# EAGLE design otterley_A_v1_1 (EAGLE 9.6.2)

## Sheet 1 of 2: LFO B
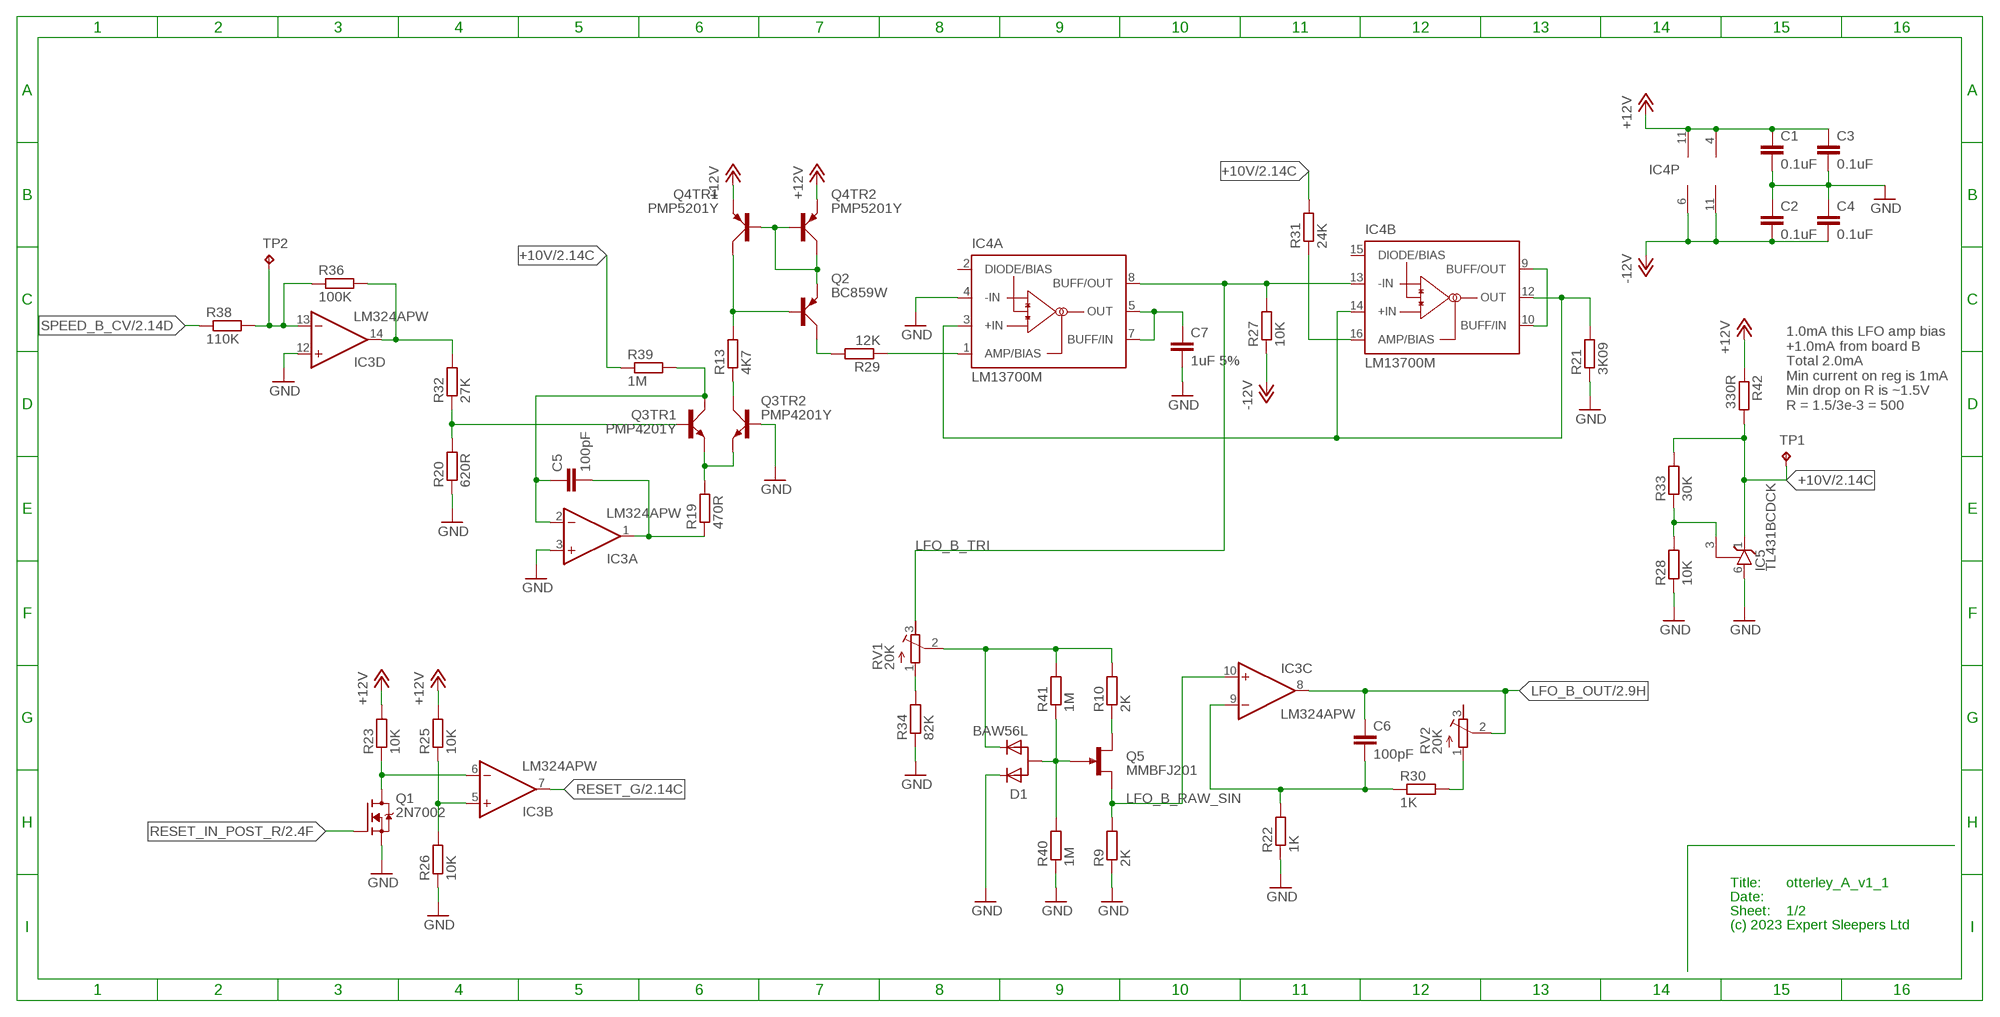
[diagram p0: schematic, sheet 1]

### Parts
C1  0.1uF  C-EUC0402  [C0402]
C2  0.1uF  C-EUC0402  [C0402]
C3  0.1uF  C-EUC0402  [C0402]
C4  0.1uF  C-EUC0402  [C0402]
C5  100pF  C-EUC0603  [C0603]
C6  100pF  C-EUC0603  [C0603]
C7  1uF 5%  C-EUC0805  [C0805]
D1  BAW56L  [SOT-23]
IC3  LM324APW  TL074PW  [PW_R-PDSO-G14]
IC4  LM13700M  [SO16]
IC5  TL431BCDCK  [DCK_SC-70]
Q1  2N7002  [SOT23]
Q2  BC859W  [SOT323]
Q3  PMP4201Y  [SOT65P210X110-6N]
Q4  PMP5201Y  [SOT65P210X110-6N]
Q5  MMBFJ201  MMBFJ3  [SOT23]
R9  2K  R-EU_R1206  [R1206]
R10  2K  R-EU_R1206  [R1206]
R13  4K7  R-EU_R1206  [R1206]
R19  470R  R-EU_R1206  [R1206]
R20  620R  R-EU_R0603  [R0603]
R21  3K09  R-EU_R0603  [R0603]
R22  1K  R-EU_R0603  [R0603]
R23  10K  R-EU_R0603  [R0603]
R25  10K  R-EU_R0603  [R0603]
R26  10K  R-EU_R0603  [R0603]
R27  10K  R-EU_R0603  [R0603]
R28  10K  R-EU_R0603  [R0603]
R29  12K  R-EU_R0603  [R0603]
R30  1K  R-EU_R0603  [R0603]
R31  24K  R-EU_R0603  [R0603]
R32  27K  R-EU_R0603  [R0603]
R33  30K  R-EU_R0603  [R0603]
R34  82K  R-EU_R0603  [R0603]
R36  100K  R-EU_R0603  [R0603]
R38  110K  R-EU_R0603  [R0603]
R39  1M  R-EU_R0603  [R0603]
R40  1M  R-EU_R0603  [R0603]
R41  1M  R-EU_R0603  [R0603]
R42  330R  R-EU_R1206  [R1206]
RV1  20K  3306W  [3306_W]
RV2  20K  3306W  [3306_W]
TP1  RA2  TPPAD1-13  [P1-13]
TP2  RA2  TPPAD1-13  [P1-13]

### Nets
+10V: IC5.1(C) R31.2 R33.2 R39.1 R42.2 TP1.TP ; also sheet 2
+12V: C1.1 C3.1 IC3.4(P:V+) IC4.11(P:V+) Q4.4(TR2:E) Q4.5(TR1:E) R23.2 R25.2 R42.1 ; also sheet 2
-12V: C2.2 C4.2 IC3.11(P:V-) IC4.6(P:V-) R27.1 ; also sheet 2
GND [power]: C1.2 C2.1 C3.2 C4.1 C7.2 D1.1(C1) IC3.3(A:+IN) IC3.12(D:+IN) IC4.4(A:-IN) IC5.6(A) Q1.2(S) Q3.2(TR2:B) R9.1 R20.1 R21.1 R22.1 R26.1 R28.1 R34.1 R40.1 ; also sheet 2
LFO_B_OUT: C6.1 IC3.8(C:OUT) RV2.2(S) ; also sheet 2
LFO_B_RAW_SIN: IC3.10(C:+IN) Q5.2(S) R9.2
LFO_B_TRI: IC4.8(A:BUFF/OUT) IC4.13(B:-IN) R27.2 RV1.3(E)
N$21: IC5.3(R) R28.2 R33.1
N$45: IC3.6(B:-IN) Q1.3(D) R23.1
N$46: IC3.5(B:+IN) R25.1 R26.2
N$50: IC3.14(D:OUT) R32.2 R36.2
N$55: IC4.9(B:BUFF/OUT) IC4.10(B:BUFF/IN)
N$59: C7.1 IC4.5(A:OUT) IC4.7(A:BUFF/IN)
N$60: IC4.3(A:+IN) IC4.12(B:OUT) IC4.14(B:+IN) R21.2
N$61: IC4.16(B:AMP/BIAS) R31.1
N$64: IC4.1(A:AMP/BIAS) R29.1
N$67: IC3.13(D:-IN) R36.1 R38.2 TP2.TP
N$68: C5.1 IC3.2(A:-IN) Q3.6(TR1:C) R39.2
N$69: C5.2 IC3.1(A:OUT) R19.1
N$70: Q3.4(TR2:E) Q3.5(TR1:E) R19.2
N$73: Q3.1(TR1:B) R20.2 R32.1
N$76: Q2.3(C) R29.2
N$77: Q2.1(B) Q4.6(TR1:C) R13.2
N$78: Q2.2(E) Q4.1(TR1:B) Q4.2(TR2:B) Q4.3(TR2:C)
N$79: Q3.3(TR2:C) R13.1
N$82: R34.2 RV1.1(A)
N$83: D1.2(C2) R10.2 R41.2 RV1.2(S)
N$84: D1.3(A) Q5.3(G) R40.2 R41.1
N$85: Q5.1(D) R10.1
N$86: C6.2 IC3.9(C:-IN) R22.2 R30.1
N$88: R30.2 RV2.1(A)
RESET_G: IC3.7(B:OUT) ; also sheet 2
RESET_IN_POST_R: Q1.1(G) ; also sheet 2
SPEED_B_CV: R38.1 ; also sheet 2
Unconnected: IC4.2(A:DIODE/BIAS) IC4.15(B:DIODE/BIAS) RV2.3(E)

### Notes on the sheet
- 1.0mA this LFO amp bias
  +1.0mA from board B
  Total 2.0mA
  Min current on reg is 1mA
  Min drop on R is ~1.5V
  R = 1.5/3e-3 = 500
- Title:
- Date:
- Sheet:
- (c) 2023 Expert Sleepers Ltd

## Sheet 2 of 2: CV I/O
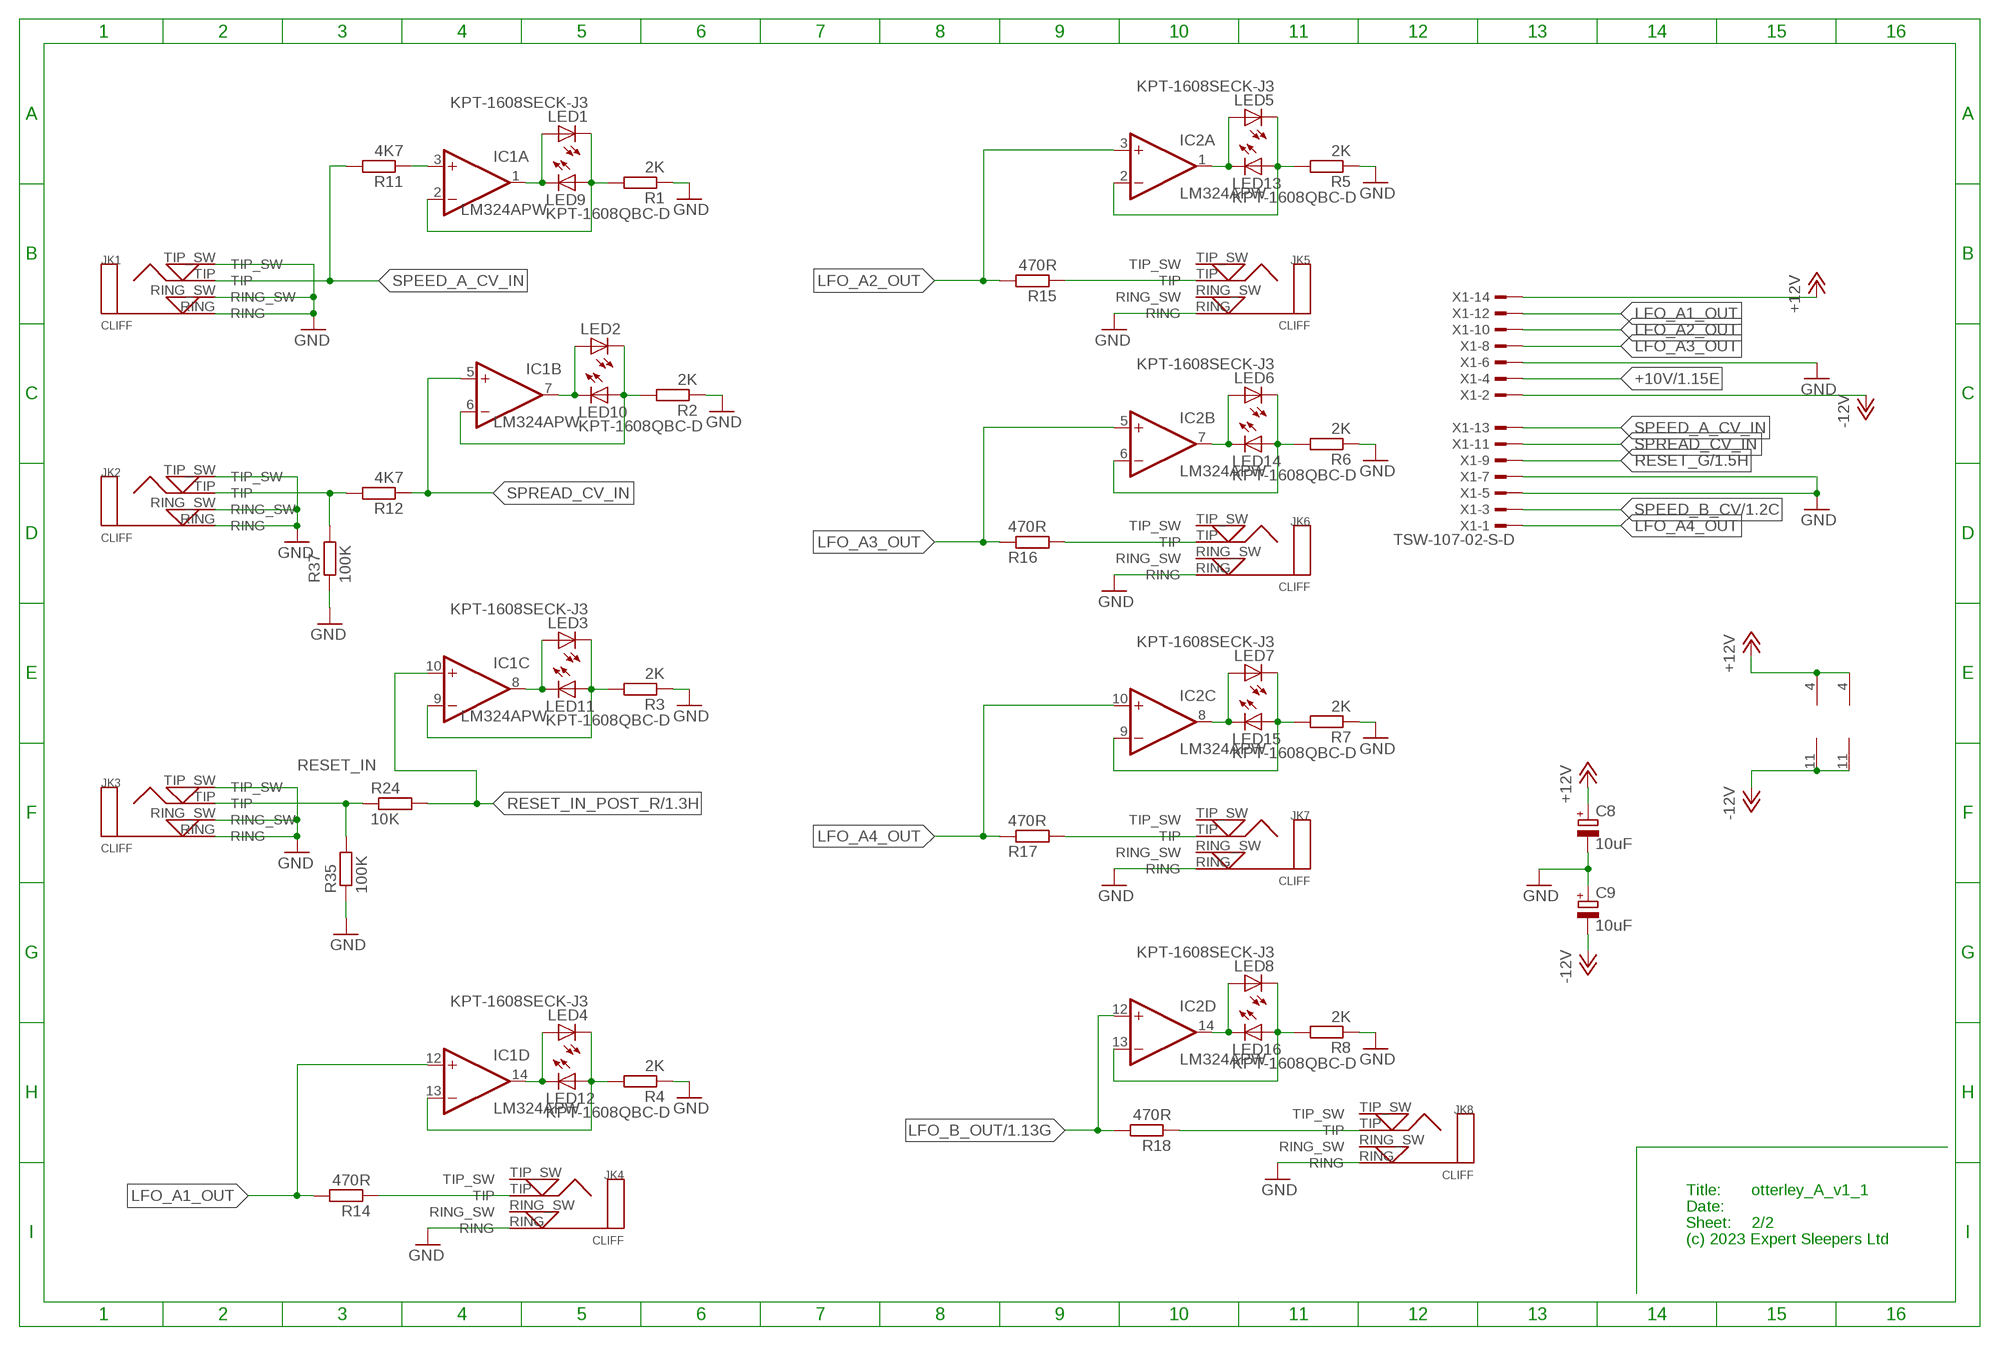
[diagram p1: schematic, sheet 2]

### Parts
C8  10uF  CPOL-EUUD-4X5,8  [UD-4X5,8_NICHICON]
C9  10uF  CPOL-EUUD-4X5,8  [UD-4X5,8_NICHICON]
IC1  LM324APW  TL074PW  [PW_R-PDSO-G14]
IC2  LM324APW  TL074PW  [PW_R-PDSO-G14]
JK1  CLIFF  CLIFF3.5MM_PCB_SW_JK  [CLIFF3.5MMPCB]
JK2  CLIFF  CLIFF3.5MM_PCB_SW_JK  [CLIFF3.5MMPCB]
JK3  CLIFF  CLIFF3.5MM_PCB_SW_JK  [CLIFF3.5MMPCB]
JK4  CLIFF  CLIFF3.5MM_PCB_SW_JK  [CLIFF3.5MMPCB]
JK5  CLIFF  CLIFF3.5MM_PCB_SW_JK  [CLIFF3.5MMPCB]
JK6  CLIFF  CLIFF3.5MM_PCB_SW_JK  [CLIFF3.5MMPCB]
JK7  CLIFF  CLIFF3.5MM_PCB_SW_JK  [CLIFF3.5MMPCB]
JK8  CLIFF  CLIFF3.5MM_PCB_SW_JK  [CLIFF3.5MMPCB]
LED1  KPT-1608SECK-J3  [CHIPLED_0603_LEFT]
LED2  KPT-1608SECK-J3  [CHIPLED_0603_LEFT]
LED3  KPT-1608SECK-J3  [CHIPLED_0603_LEFT]
LED4  KPT-1608SECK-J3  [CHIPLED_0603_LEFT]
LED5  KPT-1608SECK-J3  [CHIPLED_0603_LEFT]
LED6  KPT-1608SECK-J3  [CHIPLED_0603_LEFT]
LED7  KPT-1608SECK-J3  [CHIPLED_0603_LEFT]
LED8  KPT-1608SECK-J3  [CHIPLED_0603_LEFT]
LED9  KPT-1608QBC-D  [CHIPLED_0603_RIGHT]
LED10  KPT-1608QBC-D  [CHIPLED_0603_RIGHT]
LED11  KPT-1608QBC-D  [CHIPLED_0603_RIGHT]
LED12  KPT-1608QBC-D  [CHIPLED_0603_RIGHT]
LED13  KPT-1608QBC-D  [CHIPLED_0603_RIGHT]
LED14  KPT-1608QBC-D  [CHIPLED_0603_RIGHT]
LED15  KPT-1608QBC-D  [CHIPLED_0603_RIGHT]
LED16  KPT-1608QBC-D  [CHIPLED_0603_RIGHT]
R1  2K  R-EU_R1206  [R1206]
R2  2K  R-EU_R1206  [R1206]
R3  2K  R-EU_R1206  [R1206]
R4  2K  R-EU_R1206  [R1206]
R5  2K  R-EU_R1206  [R1206]
R6  2K  R-EU_R1206  [R1206]
R7  2K  R-EU_R1206  [R1206]
R8  2K  R-EU_R1206  [R1206]
R11  4K7  R-EU_R1206  [R1206]
R12  4K7  R-EU_R1206  [R1206]
R14  470R  R-EU_R1206  [R1206]
R15  470R  R-EU_R1206  [R1206]
R16  470R  R-EU_R1206  [R1206]
R17  470R  R-EU_R1206  [R1206]
R18  470R  R-EU_R1206  [R1206]
R24  10K  R-EU_R0603  [R0603]
R35  100K  R-EU_R0603  [R0603]
R37  100K  R-EU_R0603  [R0603]
X1  TSW-107-02-S-D  [TSW-107-02-S-D]

### Nets
+10V: X1.4 ; also sheet 1
+12V: C8.+ IC1.4(P:V+) IC2.4(P:V+) X1.14 ; also sheet 1
-12V: C9.- IC1.11(P:V-) IC2.11(P:V-) X1.2 ; also sheet 1
GND [power]: C8.- C9.+ JK1.RING JK1.RING_SW JK1.TIP_SW JK2.RING JK2.RING_SW JK2.TIP_SW JK3.RING JK3.RING_SW JK3.TIP_SW JK4.RING JK5.RING JK6.RING JK7.RING JK8.RING R1.1 R2.1 R3.1 R4.1 R5.1 R6.1 R7.1 R8.1 R35.1 R37.1 X1.5 X1.6 X1.7 ; also sheet 1
LFO_A1_JACK: JK4.TIP R14.1
LFO_A1_OUT: IC1.12(D:+IN) R14.2 X1.12
LFO_A2_JACK: JK5.TIP R15.1
LFO_A2_OUT: IC2.3(A:+IN) R15.2 X1.10
LFO_A3_JACK: JK6.TIP R16.2
LFO_A3_OUT: IC2.5(B:+IN) R16.1 X1.8
LFO_A4_JACK: JK7.TIP R17.2
LFO_A4_OUT: IC2.10(C:+IN) R17.1 X1.1
LFO_B_JACK: JK8.TIP R18.1
LFO_B_OUT: IC2.12(D:+IN) R18.2 ; also sheet 1
N$4: IC1.13(D:-IN) LED4.1(C) LED12.1(A) R4.2
N$5: IC1.14(D:OUT) LED4.2(A) LED12.2(C)
N$6: IC2.2(A:-IN) LED5.1(C) LED13.1(A) R5.2
N$11: IC1.8(C:OUT) LED3.2(A) LED11.2(C)
N$16: JK2.TIP R12.2 R37.2
N$17: IC1.9(C:-IN) LED3.1(C) LED11.1(A) R3.2
N$19: IC1.1(A:OUT) LED1.2(A) LED9.2(C)
N$22: IC1.2(A:-IN) LED1.1(C) LED9.1(A) R1.2
N$25: IC1.3(A:+IN) R11.1
N$29: IC1.7(B:OUT) LED2.2(A) LED10.2(C)
N$30: IC1.6(B:-IN) LED2.1(C) LED10.1(A) R2.2
N$62: IC2.8(C:OUT) LED7.2(A) LED15.2(C)
N$63: IC2.9(C:-IN) LED7.1(C) LED15.1(A) R7.2
N$65: IC2.14(D:OUT) LED8.2(A) LED16.2(C)
N$66: IC2.13(D:-IN) LED8.1(C) LED16.1(A) R8.2
N$71: IC2.7(B:OUT) LED6.2(A) LED14.2(C)
N$72: IC2.6(B:-IN) LED6.1(C) LED14.1(A) R6.2
N$89: IC2.1(A:OUT) LED5.2(A) LED13.2(C)
RESET_G: X1.9 ; also sheet 1
RESET_IN: JK3.TIP R24.1 R35.2
RESET_IN_POST_R: IC1.10(C:+IN) R24.2 ; also sheet 1
SPEED_A_CV_IN: JK1.TIP R11.2 X1.13
SPEED_B_CV: X1.3 ; also sheet 1
SPREAD_CV_IN: IC1.5(B:+IN) R12.1 X1.11
Unconnected: JK4.RING_SW JK4.TIP_SW JK5.RING_SW JK5.TIP_SW JK6.RING_SW JK6.TIP_SW JK7.RING_SW JK7.TIP_SW JK8.RING_SW JK8.TIP_SW

### Notes on the sheet
- Title:
- Date:
- Sheet:
- (c) 2023 Expert Sleepers Ltd

## Library data of the parts
C1-C7 = rcl:C-EU: CAPACITOR, European symbol
C8 C9 = rcl:CPOL-EU: POLARIZED CAPACITOR, European symbol
D1 = diodes:BAW56L
IC1-IC3 = digital-audio:TL074: OP AMP
IC4 = texas:LM13700: Dual Operational Transconductance Amplifiers with Linearizing Diodes and Buffers Source: lm13700.PDF
IC5 = texas:TL431*
JK1-JK8 = cliff:CLIFF3.5MM_PCB_SW_JK: Cliff 3.5mm Mono PCB switched jack socket
LED1-LED8 = kingbright:KPT-1608SECK-J3
LED9-LED16 = kingbright:KPT-1608QBC-D
Q1 = digital-audio:2N7002: 2N7002 N-channel MOSFET
Q2 = NXP:BC859W
Q3 = SamacSys_Parts:PMP4201Y: Bipolar Transistors - BJT MATCHED PAIR Source: Datasheet <https://componentsearchengine.com/Datasheets/1/PMP4201Y,135.pdf>; ARROW_PART_NUMBER: PMP4201Y,135; ARROW_PRICE-STOCK: https://www.arrow.com/en/products/pmp4201y135/nexperia; DESCRIPTION: Bipolar Transistors - BJT MATCHED PAIR; HEIGHT: 1.1mm; MANUFACTURER_NAME: Nexperia; MANUFACTURER_PART_NUMBER: PMP4201Y,135; MOUSER_PART_NUMBER: 771-PMP4201Y135; MOUSER_PRICE-STOCK: https://www.mouser.co.uk/ProductDetail/Nexperia/PMP4201Y135?qs=LOCUfHb8d9uqwNS3d98RHQ%3D%3D
Q4 = SamacSys_Parts:PMP5201Y: Bipolar Transistors - BJT MATCHED PAIR Source: Datasheet <https://eu.mouser.com/datasheet/2/268/40001414E-1066494.pdf>; ARROW_PART_NUMBER: PMP5201Y,135; ARROW_PRICE-STOCK: https://www.arrow.com/en/products/pmp5201y135/nexperia; DESCRIPTION: Bipolar Transistors - BJT MATCHED PAIR; HEIGHT: 1.1mm; MANUFACTURER_NAME: Nexperia; MANUFACTURER_PART_NUMBER: PMP5201Y,135; MOUSER_PART_NUMBER: 771-PMP5201Y135; MOUSER_PRICE-STOCK: https://www.mouser.co.uk/ProductDetail/Nexperia/PMP5201Y135?qs=LOCUfHb8d9vvvsx1DGNhtA%3D%3D
Q5 = transistor-small-signal:MMBFJ3*: N-Channel RF Amplifier Source: http://www.fairchildsemi.com/pf/J3/J310.html
R1-R42 = rcl:R-EU_: RESISTOR, European symbol
RV1 RV2 = bourns:3306
TP1 TP2 = testpad:TP: Test pad
X1 = con-samtec:TSW-107-02-S-D: THROUGH-HOLE .025" SQ POST HEADER Source: Samtec TSW.pdf; OC_FARNELL: unknown; OC_NEWARK: unknown

## Board
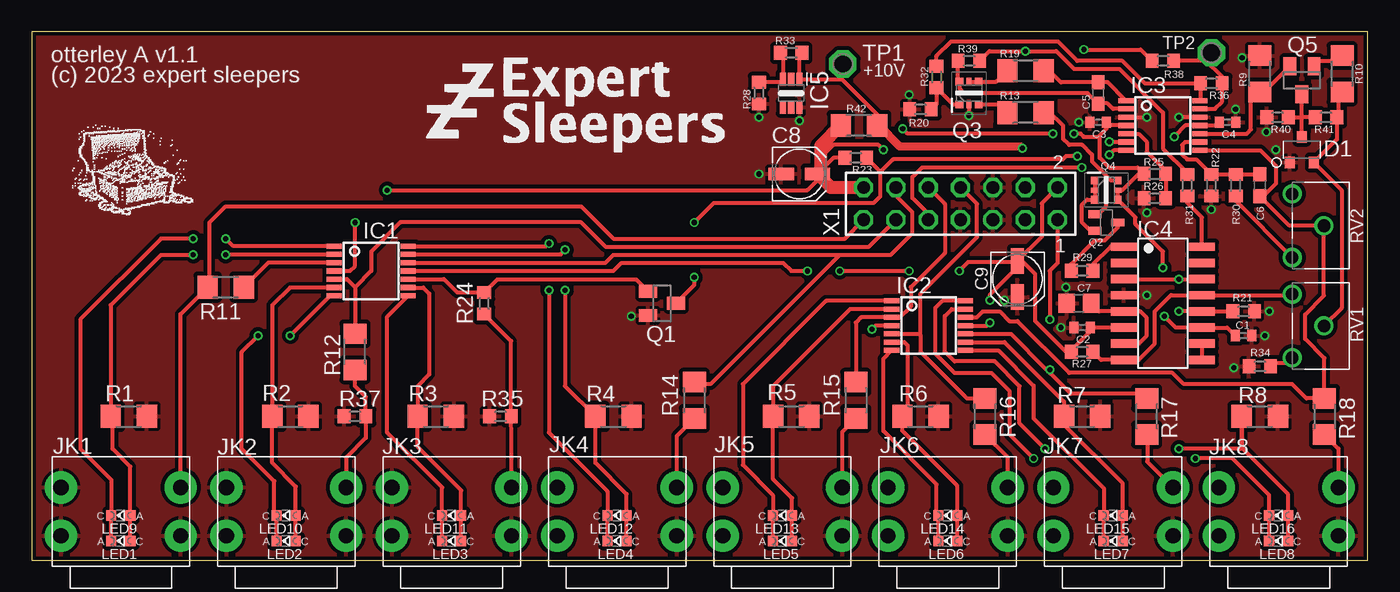
[diagram p2: board, top side]
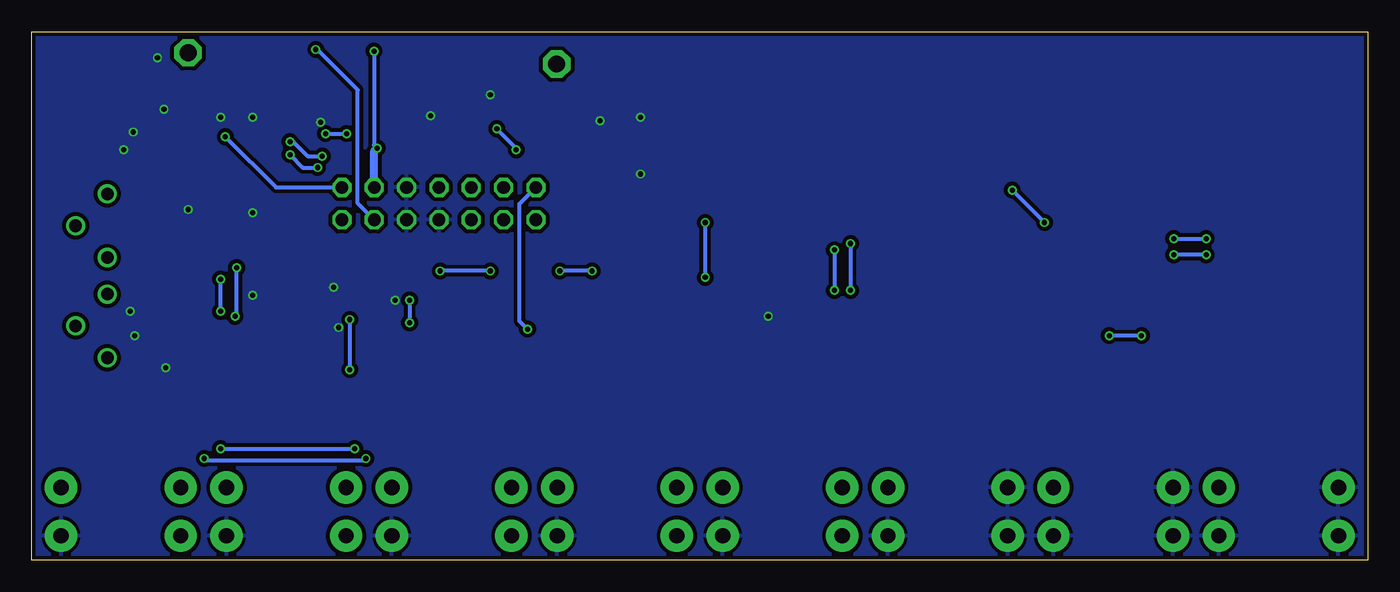
[diagram p3: board, bottom side, seen from below]

Size 105 x 41.5 mm. Coordinates in mm from the lower left corner, seen from the top.
Outline: 0,0 105,0 105,41.5 0,41.5 0,0
Copper layers (1*16): Top 0.035mm / dielectric 1.5mm / Bottom 0.035mm
Design rules "pcbtrain *": minimum track width 0.125mm, minimum drill 0.3mm, track to track 0.125mm, track to pad 0.125mm, pad to pad 0.125mm, via to via 0.125mm, smd to smd 0.125mm, copper to edge 0.25mm, drill to drill 8mil, minimum pad ring 0.15mm, minimum via ring 0.15mm, stop-mask expansion 4mil, vias tented up to drill 0mil, thermal gap 10mil

### Footprints (pad centres in the part's own frame; a part is rotated, then mirrored left to right if it is on the bottom)
C0402 = smd 0.7 x 0.9: 1 -0.65,0; 2 0.65,0
C0603 = smd 1.1 x 1: 1 -0.85,0; 2 0.85,0
C0805 = smd 1.3 x 1.5: 1 -0.95,0; 2 0.95,0
UD-4X5,8_NICHICON = smd 2 x 1: + 1.425,0; - -1.425,0
SOT-23 = smd 0.8 x 0.9: 1 -0.95,-1; 2 0.95,-1; 3 0,1
PW_R-PDSO-G14 = smd 0.4 x 1.2: 1 -1.95,-2.9; 2 -1.3,-2.9; 3 -0.65,-2.9; 4 0,-2.9; 5 0.65,-2.9; 6 1.3,-2.9; 7 1.95,-2.9; 8 1.95,2.9; 9 1.3,2.9; 10 0.65,2.9; 11 0,2.9; 12 -0.65,2.9; 13 -1.3,2.9; 14 -1.95,2.9
SO16 = smd 0.66 x 2.032: 1 -4.445,-3.073; 2 -3.175,-3.073; 3 -1.905,-3.073; 4 -0.635,-3.073; 5 0.635,-3.073; 6 1.905,-3.073; 7 3.175,-3.073; 8 4.445,-3.073; 9 4.445,3.073; 10 3.175,3.073; 11 1.905,3.073; 12 0.635,3.073; 13 -0.635,3.073; 14 -1.905,3.073; 15 -3.175,3.073; 16 -4.445,3.073
DCK_SC-70 = smd 1 x 0.5: 1 -1.1,0.65; 2 -1.1,0; 3 -1.1,-0.65; 4 1.1,-0.65; 5 1.1,0; 6 1.1,0.65
CLIFF3.5MMPCB = drill 1.2 pad 2.54: RING 4.7,-1.9; RING_SW -4.7,-1.9; TIP 4.7,1.9; TIP_SW -4.7,1.9
CHIPLED_0603_LEFT = smd 0.8 x 0.8: 1 0,-0.75; 2 0,0.75
CHIPLED_0603_RIGHT = smd 0.8 x 0.8: 1 0,-0.75; 2 0,0.75
SOT23 = smd 1 x 1.4: 1 -0.95,-1.1; 2 0.95,-1.1; 3 0,1.1
SOT323 = smd 0.6 x 1: 1 -0.65,-0.9; 2 0.65,-0.9; 3 0,0.9
SOT65P210X110-6N = smd 0.6 x 0.6: 1 -0.9,0.75; 3 -0.9,-0.75; 4 0.9,-0.75; 6 0.9,0.75 | smd 0.6 x 0.4: 2 -0.9,0; 5 0.9,0
R1206 = smd 1.6 x 1.803: 1 -1.422,0; 2 1.422,0
R0603 = smd 1 x 1.1: 1 -0.85,0; 2 0.85,0
3306_W = drill 1: 1 -2.5,0; 2 0,-2.5; 3 2.5,0
P1-13 = drill 1.321 pad 2.159 octagon: TP 0,0
TSW-107-02-S-D = drill 1 pad 1.5 octagon: 1 7.62,-1.27; 2 7.62,1.27; 3 5.08,-1.27; 4 5.08,1.27; 5 2.54,-1.27; 6 2.54,1.27; 7 0,-1.27; 8 0,1.27; 9 -2.54,-1.27; 10 -2.54,1.27; 11 -5.08,-1.27; 12 -5.08,1.27; 13 -7.62,-1.27; 14 -7.62,1.27

### Placement (x,y rotation side)
C1  95.25,17.63 0 top
C2  82.55,18.27 0 top
C3  83.82,34.39 180 top
C4  93.98,34.39 180 top
C5  83.82,36.68 90 top
C6  96.52,29.44 90 top
C7  82.3,20.17 180 top
C8  60.33,30.33 0 top
C9  77.47,22.07 270 top
D1  99.82,32.23 0 top
IC1  26.67,22.71 270 top
IC2  70.48,18.41 270 top
IC3  88.9,34.14 270 top
IC4  88.9,20.17 270 top
IC5  59.69,36.68 270 top
JK1  7,3.8 0 top
JK2  20,3.8 0 top
JK3  33,3.8 0 top
JK4  46,3.8 0 top
JK5  59,3.8 0 top
JK6  72,3.8 0 top
JK7  85,3.8 0 top
JK8  98,3.8 0 top
LED1  7,1.5 90 top
LED2  20,1.5 90 top
LED3  33,1.5 90 top
LED4  46,1.5 90 top
LED5  59,1.5 90 top
LED6  72,1.5 90 top
LED7  85,1.5 90 top
LED8  98,1.5 90 top
LED9  7,3.5 90 top
LED10  20,3.5 90 top
LED11  33,3.5 90 top
LED12  46,3.5 90 top
LED13  59,3.5 90 top
LED14  72,3.5 90 top
LED15  85,3.5 90 top
LED16  98,3.5 90 top
Q1  49.53,20.17 270 top
Q2  84.45,26.52 270 top
Q3  73.66,36.68 90 top
Q4  84.45,29.06 0 top
Q5  99.82,37.7 180 top
R1  7.62,11.28 180 top
R2  20.32,11.28 180 top
R3  31.75,11.28 180 top
R4  45.72,11.28 180 top
R5  59.69,11.28 180 top
R6  69.85,11.28 180 top
R7  82.55,11.28 180 top
R8  96.52,11.28 180 top
R9  96.52,38.2 270 top
R10  103,38.2 270 top
R11  15.24,21.44 180 top
R12  25.4,16.36 270 top
R13  78.11,35.16 0 top
R14  52.07,12.55 90 top
R15  64.77,12.55 90 top
R16  74.93,11.28 270 top
R17  87.63,11.28 270 top
R18  101.6,11.28 90 top
R19  78.11,38.46 180 top
R20  69.85,35.41 0 top
R21  95.25,19.54 180 top
R22  92.71,29.44 90 top
R23  64.77,31.6 180 top
R24  35.56,20.17 90 top
R25  88.27,30.33 180 top
R26  88.27,28.43 0 top
R27  82.55,16.36 0 top
R28  57.15,36.68 90 top
R29  82.55,22.71 180 top
R30  94.61,29.44 270 top
R31  90.81,29.44 90 top
R32  71.12,37.95 90 top
R33  59.69,39.85 0 top
R34  96.52,15.22 0 top
R35  36.83,11.28 0 top
R36  92.71,37.44 180 top
R37  25.4,11.28 0 top
R38  88.9,39.22 0 top
R39  73.66,39.22 180 top
R40  97.92,34.77 0 top
R41  101.73,34.77 0 top
R42  65.02,34.14 0 top
RV1  99.06,18.39 90 top
RV2  99.06,26.27 90 top
TP1  63.75,38.97 0 top
TP2  92.71,39.85 0 top
U$1  [ES_ZZZ_TEXT_TPLACE_1IN_600DPI]  30.02,31.61 0 top
U$2  [TREASURE_10MM_300DPI]  2.81,27.05 0 top
X1  73,28 0 top

### Tracks (layer width: path | path; a pad name or v marks a point on that pad's centre or on a via)
+10V  (via drill 0.4)
  Top 0.305: R31.2 90.81,30.42 88.9,32.32 88.9,35.16 85.47,38.59 81.92,38.59 80.52,39.98 v78.11,39.98 75.27,39.98 R39.1 | R33.2 60.34,39.66 IC5.1 63.5,37.78 | 63.5,37.78 63.67,37.78 66.45,35 R42.2 | TP1.TP 63.5,38.71 63.5,37.78
  Top 0.61: v77.85,32.36 77.72,32.49 68.22,32.49 66.57,34.14 R42.2
  Bottom 0.305: v78.11,39.98 78.11,32.62 v77.85,32.36
  Bottom 0.61: X1.4 78.08,32.13 v77.85,32.36
+12V  (via drill 0.4)
  Top 0.305: C1.1 93.97,18.27 IC4.11 89.92,18.27 v89.03,19.15 | IC3.4 84.72,34.14 C3.1 84.47,33.9 83.82,33.25 | R23.2 63.02,31.6 61.99,30.57 C8.+ 61.75,29.85 60.96,29.06 v27.94,29.06 | IC1.4 25.02,22.71 25.4,23.09 v25.4,26.52 | IC2.4 66.32,18.41 v66.04,18.14 | v88.9,22.96 88.9,24.23 86.74,26.39 86.74,26.92 Q4.4 Q4.5 85.72,29.06 87,30.33 R25.2 86.91,30.84 84.71,30.84 83.95,31.6 83.95,33.12 83.82,33.25 | 83.82,33.25 82.68,33.25 82.42,33.51 v81.92,33.51 | v80.26,33.51 68.83,33.51 v68.45,33.89 | v66.93,32.23 66.55,32.62 63.01,32.62 61.99,31.6
  Top 1.016: C8.+ 62.81,29.27 X1.14 | R42.1 61.99,32.53 61.99,31.6 61.99,30.57
  Bottom 0.305: v25.4,26.52 v27.94,29.06 | v66.04,18.14 66.67,18.77 66.67,27.98 X1.14 | v89.03,19.15 88.9,19.28 v88.9,22.96 | v81.92,33.51 v80.26,33.51 | v68.45,33.89 66.93,32.36 v66.93,32.23
-12V  (via drill 0.4)
  Top 0.305: IC4.6 C2.2 83.2,17.99 81.7,16.49 R27.1 81.28,16.36 78.87,18.77 78.87,22.46 77.9,23.42 | C4.2 93.08,34.14 IC3.11 90.68,34.14 v89.79,33.25 | X1.2 79.38,28.02 79.38,25.41 C9.- 77.39,23.42 | IC2.11 75.08,18.41 v75.31,18.65 | v75.31,20.42 75.31,20.83 77.9,23.42 | IC1.11 45.72,22.71 46.35,23.34 59.05,23.34 59.69,22.71 v60.96,22.71 | v72.9,22.71 73.61,23.42 77.39,23.42 | 77.39,23.42 77.9,23.42 | v63.5,22.71 v68.96,22.71
  Bottom 0.305: v75.31,20.42 v75.31,18.65 | v89.79,33.25 85.81,29.27 X1.2 | v60.96,22.71 v63.5,22.71 | v68.96,22.71 v72.9,22.71
GND  (via drill 0.4)
  Top 0.305: Q3.2 v73.66,34.9 | IC3.3 87.61,34.79 v87.63,34.77 | IC3.12 91.78,34.77 v90.17,34.77
  other vias: 87.63,20.8 82.3,34.39 94.61,35.41 95.12,39.47 97.79,32.23 94.49,15.09 97.28,19.54 96.9,17.63 80.9,18.27 81.28,21.44 92.71,27.54 68.96,36.55 57.15,34.77 60.33,34.52 47.12,19.15 87.63,27.28 57.15,30.33 76.45,20.42 97.03,33.63
  pour Top (isolate 0.305): 0,0 105,0 105,41.5 0,41.5
  pour Bottom (isolate 0.305): 0,0 105,0 105,41.5 0,41.5
LFO_A1_JACK
  Top 0.305: JK4.TIP 50.7,9.76 R14.1
LFO_A1_OUT
  Top 0.305: 63.5,23.98 53.34,13.82 52.07,13.82 R14.2 | X1.12 67.92,28.64 69.22,27.34 69.22,25.68 67.51,23.98 63.5,23.98 | IC1.12 45.1,23.36 45.72,23.98 63.5,23.98
LFO_A2_JACK
  Top 0.305: JK5.TIP 63.7,10.06 R15.1
LFO_A2_OUT
  Top 0.305: R15.2 64.77,18.65 65.19,19.07 IC2.3 68.24,19.07 69.09,19.92 69.09,21.44 71.75,24.11 71.75,27.98 X1.10
LFO_A3_JACK
  Top 0.305: JK6.TIP 76.7,8.09 R16.2
LFO_A3_OUT
  Top 0.305: R16.1 73.51,12.7 69.85,16.36 69.85,17.63 | IC2.5 69.72,17.77 69.85,17.63 | X1.8 74.3,27.98 74.3,25.38 69.85,20.93 69.85,17.63
LFO_A4_JACK
  Top 0.305: JK7.TIP 87.67,7.73 87.67,9.82 R17.2
LFO_A4_OUT  (via drill 0.4)
  Top 0.305: R17.1 87.63,13.06 81.66,13.06 80.01,14.71 v80.01,14.96 79.76,14.96 76.95,17.77 IC2.10 | X1.1 80.62,23.32 80.01,22.71 v80.01,18.9
  Bottom 0.305: v80.01,18.9 v80.01,14.96
LFO_B_JACK
  Top 0.305: R18.1 102.7,8.76 JK8.TIP
LFO_B_OUT
  Top 0.305: IC3.8 96.56,32.19 97.79,30.96 97.79,29.57 96.81,28.59 C6.1 98.84,26.27 RV2.2 101.56,20.77 100.08,19.28 100.08,17.38 101.6,15.85 R18.2 100.18,12.7 99.06,13.82 90.55,13.82 89.66,14.71 81.53,14.71 77.47,18.77 76.83,18.77 76.07,19.54 74.74,19.54 74.27,19.07 IC2.12
LFO_B_RAW_SIN
  Top 0.305: IC3.10 95.48,33.49 95.82,33.83 95.82,36.08 R9.2 96.86,36.78 Q5.2
LFO_B_TRI
  Top 0.305: R27.2 84.03,15.72 IC4.8 87,15.72 88.27,17 88.27,19.54 89.53,20.8 IC4.13 99.45,20.8 RV1.3
N$4  (via drill 0.4)
  Top 0.305: LED4.1 LED12.1 46.75,5.17 44.3,7.62 R4.2 41.91,13.67 v41.91,21.19 | IC1.13 41.56,24.01 v41.91,24.36
  Bottom 0.305: v41.91,24.36 v41.91,21.19
N$5  (via drill 0.4)
  Top 0.305: LED4.2 LED12.2 45.25,5.4 40.64,10.01 v40.64,21.19 | IC1.14 40.43,24.66 v40.64,24.87
  Bottom 0.305: v40.64,24.87 v40.64,21.19
N$6
  Top 0.305: LED5.1 LED13.1 59.75,4.87 58.27,6.35 R5.2 58.27,13.67 64.31,19.71 IC2.2
N$11
  Top 0.305: LED3.2 LED11.2 32.25,5.7 27.94,10.01 27.94,19.13 IC1.8
N$16
  Top 0.305: JK2.TIP 24.7,8.04 26.25,9.59 R37.2 26.25,12.82 25.4,13.67 R12.2
N$17
  Top 0.305: LED3.1 LED11.1 33.75,5.47 30.33,8.89 R3.2 30.33,13.67 31.24,14.58 31.24,20.93 30.76,21.41 IC1.9
N$19  (via drill 0.4)
  Top 0.305: LED1.2 LED9.2 6.25,6.3 3.81,8.74 3.81,18.9 10.16,25.25 v12.7,25.25 | IC1.1 15.83,24.66 v15.24,25.25
  Bottom 0.305: v15.24,25.25 v12.7,25.25
N$21
  Top 0.305: R28.2 58.79,37.53 IC5.3 59.04,39.66 R33.1
N$22  (via drill 0.4)
  Top 0.305: LED1.1 LED9.1 7.75,7.34 6.35,8.74 6.35,11.28 R1.2 6.2,20.02 10.16,23.98 v12.7,23.98 | v15.24,23.98 15.27,24.01 IC1.2
  Bottom 0.305: v12.7,23.98 v15.24,23.98
N$25
  Top 0.305: IC1.3 18.58,23.36 R11.1
N$29  (via drill 0.4)
  Top 0.305: LED2.2 LED10.2 19.05,3.7 19.05,6.2 16.51,8.74 16.51,16.36 v17.78,17.63 | v20.32,17.63 23.45,20.76 IC1.7
  Bottom 0.305: v17.78,17.63 v20.32,17.63
N$30
  Top 0.305: LED2.1 LED10.1 20.75,5.77 18.9,7.62 R2.2 18.9,20.02 20.29,21.41 IC1.6
N$45  (via drill 0.4)
  Top 0.305: IC3.6 84.74,32.84 v84.71,32.87 | v82.17,31.73 81.28,31.73 81.03,31.47 67.69,31.47 66.67,30.46 | v52.07,26.52 53.59,28.04 66.17,28.04 66.67,28.55 66.67,30.46 | R23.1 66.67,30.55 66.67,30.46 | Q1.3 52.07,21.61 v52.07,22.2
  Bottom 0.305: v84.71,32.87 84.45,32.87 83.31,31.73 v82.17,31.73 | v52.07,26.52 v52.07,22.2
N$46
  Top 0.305: R26.2 R25.1 89.11,30.58 87.63,32.07 87.63,32.87 87.01,33.49 IC3.5
N$50
  Top 0.305: IC3.14 91.86,36.15 R36.2 87.5,37.44 85.72,39.22 82.17,39.22 80.64,40.74 72.26,40.74 71.12,39.6 R32.2
N$55
  Top 0.305: IC4.10 IC4.9
N$59
  Top 0.305: IC4.7 87,17 87.63,17.63 87.63,19.03 87.12,19.54 IC4.5 83.88,19.54 C7.1
N$60  (via drill 0.4)
  Top 0.305: R21.2 IC4.12 v90.17,19.54 | IC4.3 v90.17,22.07 IC4.14
  Bottom 0.305: v90.17,19.54 v90.17,22.07
N$61
  Top 0.305: IC4.16 91.97,26.91 90.81,28.08 R31.1
N$62
  Top 0.305: LED7.2 LED15.2 84.25,5.64 78.74,11.15 78.74,13.69 75.97,16.46 IC2.8
N$63
  Top 0.305: LED7.1 LED15.1 85.75,6.02 81.13,10.64 R7.2 81.13,12.45 76.46,17.11 IC2.9
N$64
  Top 0.305: IC4.1 84.8,24.61 83.4,23.22 R29.1
N$65  (via drill 0.4)
  Top 0.305: LED8.2 LED16.2 97.25,5.09 94.36,7.98 v91.44,7.98 | IC2.14 71.57,20.36 70.99,19.79 70.99,16.23 72.52,14.71 75.44,14.71 76.83,13.31 76.83,9.88 v78.74,7.98
  Bottom 0.305: v91.44,7.98 91.31,7.85 78.87,7.85 v78.74,7.98
N$66  (via drill 0.4)
  Top 0.305: LED8.1 LED16.1 98.75,5.15 95.1,8.8 R8.2 95.1,8.87 94.97,8.74 v90.17,8.74 | v79.63,8.74 77.63,10.74 77.63,13.66 75.69,15.6 72.52,15.6 71.75,16.36 71.75,19.15 72.32,19.71 IC2.13
  Bottom 0.305: v90.17,8.74 v79.63,8.74
N$67
  Top 0.305: IC3.13 92.99,35.44 93.56,36.01 R36.1 93.56,37.95 92.29,39.22 | 92.29,39.22 R38.2 | TP2.TP 92.71,39.64 92.29,39.22
N$68
  Top 0.305: R39.2 72.81,37.68 Q3.6 72.91,37.05 73.28,36.68 82.97,36.68 C5.1 83.86,35.87 84.54,35.87 84.97,35.44 IC3.2
N$69
  Top 0.305: IC3.1 84.56,37.53 C5.2 80.9,37.53 79.63,38.8 79.42,38.8 R19.1
N$70
  Top 0.305: Q3.5 Q3.4 75.81,37.58 R19.2
N$71
  Top 0.305: LED6.2 LED14.2 71.12,3.63 71.12,5.95 66.93,10.14 66.93,15.81 IC2.7
N$72
  Top 0.305: LED6.1 LED14.1 72.75,5.84 68.43,10.16 R6.2 68.83,11.69 68.83,16.87 68.59,17.11 IC2.6
N$73
  Top 0.305: Q3.1 72.44,35.78 R32.1 71.12,35.83 R20.2
N$76
  Top 0.305: R29.2 81.7,23.26 83.57,25.12 84.33,25.12 85.36,26.15 Q2.3
N$77
  Top 0.305: Q4.6 84.85,29.81 84.45,30.2 | 84.45,30.2 83.32,31.33 83.32,31.85 82.56,32.62 81.53,32.62 81.05,33.1 81.05,34.14 80.03,35.16 R13.2 | Q2.1 83.83,27.17 84.45,27.79 84.45,30.2
N$78
  Top 0.305: Q4.1 Q4.2 Q4.3 82.94,28.31 82.55,27.92 82.55,26.52 83.2,25.87 Q2.2
N$79
  Top 0.305: R13.1 76.28,35.78 Q3.3
N$82
  Top 0.305: RV1.1 98.64,15.47 97.62,15.47 R34.2
N$83
  Top 0.305: RV1.2 102.96,19.79 102.96,29.05 D1.2 102.58,33.04 R41.2 102.7,34.9 102.7,37.06 R10.2
N$84
  Top 0.305: D1.3 99.82,34.77 | 99.82,34.77 Q5.3 | R40.2 99.82,34.77 | R41.1 99.82,34.77
N$85
  Top 0.305: R10.1 102.99,39.18 101.15,39.18 Q5.1
N$86
  Top 0.305: C6.2 R30.1 R22.2 91.53,31.47 90.81,31.47 90.42,31.85 90.42,32.62 90.65,32.84 IC3.9
N$88
  Top 0.305: R30.2 94.61,28.21 RV2.1
N$89
  Top 0.305: LED5.2 LED13.2 58.25,5.1 55.88,7.47 55.88,13.82 62.42,20.36 IC2.1
RESET_G  (via drill 0.4)
  Top 0.305: IC3.7 85.05,32.19 v84.71,31.85 | X1.9 70.46,27.21 69.22,28.46 69.22,30.08 69.98,30.84 v82.55,30.84
  Bottom 0.305: v84.71,31.85 83.69,30.84 v82.55,30.84
RESET_IN
  Top 0.305: JK3.TIP 37.7,9.56 R35.2 37.68,17.2 R24.1
RESET_IN_POST_R
  Top 0.305: IC1.10 32.4,22.06 33.44,21.02 R24.2 36.58,22.04 47.51,22.04 Q1.1
SPEED_A_CV_IN
  Top 0.305: JK1.TIP 11.7,19.32 R11.2 13.95,21.57 13.95,26.5 15.24,27.79 43.18,27.79 45.72,25.25 63.9,25.25 X1.13
SPEED_B_CV  (via drill 0.4)
  Top 0.305: v82.68,40.11 87.16,40.11 R38.1
  Bottom 0.305: X1.3 79.38,28.02 79.38,36.93 82.55,40.11 v82.68,40.11
SPREAD_CV_IN
  Top 0.305: IC1.5 24.78,22.06 25.4,21.44 | 25.4,21.44 R12.1 | X1.11 65.81,24.61 45.09,24.61 43.18,26.52 28.96,26.52 26.67,24.23 26.67,22.71 25.4,21.44

### Text on the board
tPlace: otterley A v1.1 | +10V | (c) 2023 expert sleepers